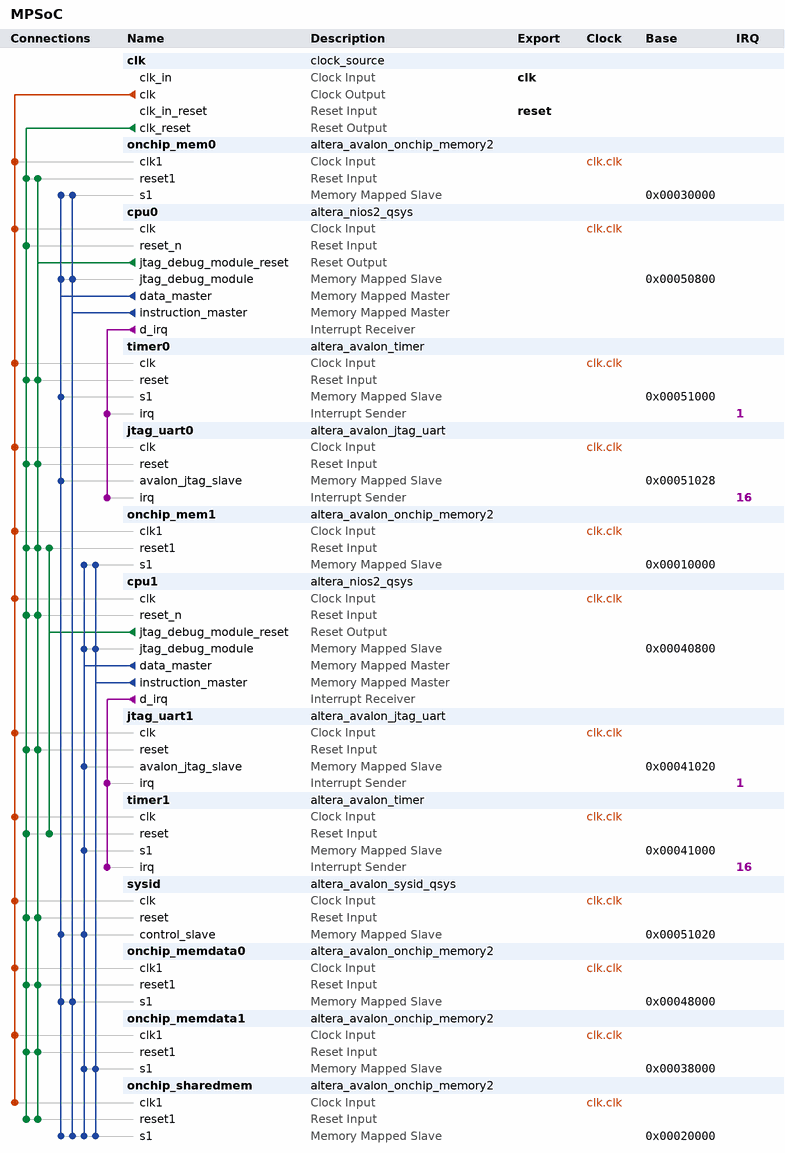
[diagram p0: system contents]
# Platform Designer (Qsys) system MPSoC, Cyclone IV E EP4CE115F29C7
# Parameters at their usual value, and those the tool derives, are not listed.
package require -exact qsys 12.1
create_system MPSoC
set_project_property DEVICE_FAMILY {Cyclone IV E}
set_project_property DEVICE EP4CE115F29C7

add_instance clk clock_source 12.1
set_instance_parameter_value clk clockFrequency 50000000

add_instance onchip_mem0 altera_avalon_onchip_memory2 12.1
set_instance_parameter_value onchip_mem0 dataWidth 32
set_instance_parameter_value onchip_mem0 dualPort false
set_instance_parameter_value onchip_mem0 initMemContent true
set_instance_parameter_value onchip_mem0 initializationFileName onchip_mem0
set_instance_parameter_value onchip_mem0 memorySize 65536

add_instance cpu0 altera_nios2_qsys 12.1
set_instance_parameter_value cpu0 resetSlave onchip_mem0.s1
set_instance_parameter_value cpu0 exceptionSlave onchip_mem0.s1
set_instance_parameter_value cpu0 breakSlave cpu0.jtag_debug_module
set_instance_parameter_value cpu0 muldiv_multiplierType NoneSmall
set_instance_parameter_value cpu0 impl Small
set_instance_parameter_value cpu0 icache_size 4096

add_instance timer0 altera_avalon_timer 12.1
set_instance_parameter_value timer0 period 1
set_instance_parameter_value timer0 periodUnits MSEC
set_instance_parameter_value timer0 timerPreset FULL_FEATURED

add_instance jtag_uart0 altera_avalon_jtag_uart 12.1
set_instance_parameter_value jtag_uart0 simInteractiveOptions INTERACTIVE_ASCII_OUTPUT

add_instance onchip_mem1 altera_avalon_onchip_memory2 12.1
set_instance_parameter_value onchip_mem1 dataWidth 32
set_instance_parameter_value onchip_mem1 dualPort false
set_instance_parameter_value onchip_mem1 initMemContent true
set_instance_parameter_value onchip_mem1 initializationFileName onchip_mem1
set_instance_parameter_value onchip_mem1 memorySize 65536

add_instance cpu1 altera_nios2_qsys 12.1
set_instance_parameter_value cpu1 resetSlave onchip_mem1.s1
set_instance_parameter_value cpu1 exceptionSlave onchip_mem1.s1
set_instance_parameter_value cpu1 breakSlave cpu1.jtag_debug_module
set_instance_parameter_value cpu1 muldiv_multiplierType NoneSmall
set_instance_parameter_value cpu1 impl Small
set_instance_parameter_value cpu1 icache_size 4096

add_instance jtag_uart1 altera_avalon_jtag_uart 12.1
set_instance_parameter_value jtag_uart1 simInteractiveOptions INTERACTIVE_ASCII_OUTPUT

add_instance timer1 altera_avalon_timer 12.1
set_instance_parameter_value timer1 period 1
set_instance_parameter_value timer1 periodUnits MSEC
set_instance_parameter_value timer1 timerPreset FULL_FEATURED

add_instance sysid altera_avalon_sysid_qsys 12.1
set_instance_parameter_value sysid id 0

add_instance onchip_memdata0 altera_avalon_onchip_memory2 12.1
set_instance_parameter_value onchip_memdata0 dataWidth 32
set_instance_parameter_value onchip_memdata0 dualPort false
set_instance_parameter_value onchip_memdata0 initMemContent true
set_instance_parameter_value onchip_memdata0 initializationFileName onchip_memdata0
set_instance_parameter_value onchip_memdata0 memorySize 32768

add_instance onchip_memdata1 altera_avalon_onchip_memory2 12.1
set_instance_parameter_value onchip_memdata1 dataWidth 32
set_instance_parameter_value onchip_memdata1 dualPort false
set_instance_parameter_value onchip_memdata1 initMemContent true
set_instance_parameter_value onchip_memdata1 initializationFileName onchip_memdata1
set_instance_parameter_value onchip_memdata1 memorySize 32768

add_instance onchip_sharedmem altera_avalon_onchip_memory2 12.1
set_instance_parameter_value onchip_sharedmem dataWidth 32
set_instance_parameter_value onchip_sharedmem dualPort false
set_instance_parameter_value onchip_sharedmem initMemContent true
set_instance_parameter_value onchip_sharedmem initializationFileName onchip_sharedmem
set_instance_parameter_value onchip_sharedmem memorySize 65536

# connections
add_connection clk.clk cpu0.clk clock
add_connection clk.clk cpu1.clk clock
add_connection clk.clk jtag_uart0.clk clock
add_connection clk.clk jtag_uart1.clk clock
add_connection clk.clk onchip_mem0.clk1 clock
add_connection clk.clk onchip_mem1.clk1 clock
add_connection clk.clk onchip_memdata0.clk1 clock
add_connection clk.clk onchip_memdata1.clk1 clock
add_connection clk.clk onchip_sharedmem.clk1 clock
add_connection clk.clk sysid.clk clock
add_connection clk.clk timer0.clk clock
add_connection clk.clk timer1.clk clock
add_connection clk.clk_reset cpu0.reset_n reset
add_connection clk.clk_reset cpu1.reset_n reset
add_connection clk.clk_reset jtag_uart0.reset reset
add_connection clk.clk_reset jtag_uart1.reset reset
add_connection clk.clk_reset onchip_mem0.reset1 reset
add_connection clk.clk_reset onchip_mem1.reset1 reset
add_connection clk.clk_reset onchip_memdata0.reset1 reset
add_connection clk.clk_reset onchip_memdata1.reset1 reset
add_connection clk.clk_reset onchip_sharedmem.reset1 reset
add_connection clk.clk_reset sysid.reset reset
add_connection clk.clk_reset timer0.reset reset
add_connection clk.clk_reset timer1.reset reset
add_connection cpu0.jtag_debug_module_reset cpu1.reset_n reset
add_connection cpu0.jtag_debug_module_reset jtag_uart0.reset reset
add_connection cpu0.jtag_debug_module_reset jtag_uart1.reset reset
add_connection cpu0.jtag_debug_module_reset onchip_mem0.reset1 reset
add_connection cpu0.jtag_debug_module_reset onchip_mem1.reset1 reset
add_connection cpu0.jtag_debug_module_reset onchip_memdata0.reset1 reset
add_connection cpu0.jtag_debug_module_reset onchip_memdata1.reset1 reset
add_connection cpu0.jtag_debug_module_reset onchip_sharedmem.reset1 reset
add_connection cpu0.jtag_debug_module_reset sysid.reset reset
add_connection cpu0.jtag_debug_module_reset timer0.reset reset
add_connection cpu1.jtag_debug_module_reset onchip_mem1.reset1 reset
add_connection cpu1.jtag_debug_module_reset timer1.reset reset
add_connection cpu0.data_master cpu0.jtag_debug_module avalon
set_connection_parameter_value cpu0.data_master/cpu0.jtag_debug_module baseAddress 0x00050800
add_connection cpu0.data_master jtag_uart0.avalon_jtag_slave avalon
set_connection_parameter_value cpu0.data_master/jtag_uart0.avalon_jtag_slave baseAddress 0x00051028
add_connection cpu0.data_master onchip_mem0.s1 avalon
set_connection_parameter_value cpu0.data_master/onchip_mem0.s1 baseAddress 0x00030000
add_connection cpu0.data_master onchip_memdata0.s1 avalon
set_connection_parameter_value cpu0.data_master/onchip_memdata0.s1 baseAddress 0x00048000
add_connection cpu0.data_master onchip_sharedmem.s1 avalon
set_connection_parameter_value cpu0.data_master/onchip_sharedmem.s1 baseAddress 0x00020000
add_connection cpu0.data_master sysid.control_slave avalon
set_connection_parameter_value cpu0.data_master/sysid.control_slave baseAddress 0x00051020
add_connection cpu0.data_master timer0.s1 avalon
set_connection_parameter_value cpu0.data_master/timer0.s1 baseAddress 0x00051000
add_connection cpu0.instruction_master cpu0.jtag_debug_module avalon
set_connection_parameter_value cpu0.instruction_master/cpu0.jtag_debug_module baseAddress 0x00050800
add_connection cpu0.instruction_master onchip_mem0.s1 avalon
set_connection_parameter_value cpu0.instruction_master/onchip_mem0.s1 baseAddress 0x00030000
add_connection cpu0.instruction_master onchip_memdata0.s1 avalon
set_connection_parameter_value cpu0.instruction_master/onchip_memdata0.s1 baseAddress 0x00048000
add_connection cpu0.instruction_master onchip_sharedmem.s1 avalon
set_connection_parameter_value cpu0.instruction_master/onchip_sharedmem.s1 baseAddress 0x00020000
add_connection cpu1.data_master cpu1.jtag_debug_module avalon
set_connection_parameter_value cpu1.data_master/cpu1.jtag_debug_module baseAddress 0x00040800
add_connection cpu1.data_master jtag_uart1.avalon_jtag_slave avalon
set_connection_parameter_value cpu1.data_master/jtag_uart1.avalon_jtag_slave baseAddress 0x00041020
add_connection cpu1.data_master onchip_mem1.s1 avalon
set_connection_parameter_value cpu1.data_master/onchip_mem1.s1 baseAddress 0x00010000
add_connection cpu1.data_master onchip_memdata1.s1 avalon
set_connection_parameter_value cpu1.data_master/onchip_memdata1.s1 baseAddress 0x00038000
add_connection cpu1.data_master onchip_sharedmem.s1 avalon
set_connection_parameter_value cpu1.data_master/onchip_sharedmem.s1 baseAddress 0x00020000
add_connection cpu1.data_master sysid.control_slave avalon
set_connection_parameter_value cpu1.data_master/sysid.control_slave baseAddress 0x00051020
add_connection cpu1.data_master timer1.s1 avalon
set_connection_parameter_value cpu1.data_master/timer1.s1 baseAddress 0x00041000
add_connection cpu1.instruction_master cpu1.jtag_debug_module avalon
set_connection_parameter_value cpu1.instruction_master/cpu1.jtag_debug_module baseAddress 0x00040800
add_connection cpu1.instruction_master onchip_mem1.s1 avalon
set_connection_parameter_value cpu1.instruction_master/onchip_mem1.s1 baseAddress 0x00010000
add_connection cpu1.instruction_master onchip_memdata1.s1 avalon
set_connection_parameter_value cpu1.instruction_master/onchip_memdata1.s1 baseAddress 0x00038000
add_connection cpu1.instruction_master onchip_sharedmem.s1 avalon
set_connection_parameter_value cpu1.instruction_master/onchip_sharedmem.s1 baseAddress 0x00020000
add_connection cpu0.d_irq jtag_uart0.irq interrupt
set_connection_parameter_value cpu0.d_irq/jtag_uart0.irq irqNumber 16
add_connection cpu0.d_irq timer0.irq interrupt
set_connection_parameter_value cpu0.d_irq/timer0.irq irqNumber 1
add_connection cpu1.d_irq jtag_uart1.irq interrupt
set_connection_parameter_value cpu1.d_irq/jtag_uart1.irq irqNumber 1
add_connection cpu1.d_irq timer1.irq interrupt
set_connection_parameter_value cpu1.d_irq/timer1.irq irqNumber 16

# exported interfaces
add_interface clk clock sink
set_interface_property clk EXPORT_OF clk.clk_in
add_interface reset reset sink
set_interface_property reset EXPORT_OF clk.clk_in_reset

save_system MPSoC.qsys
